# Altium schematic sheet Sheet1.SchDoc
size A3
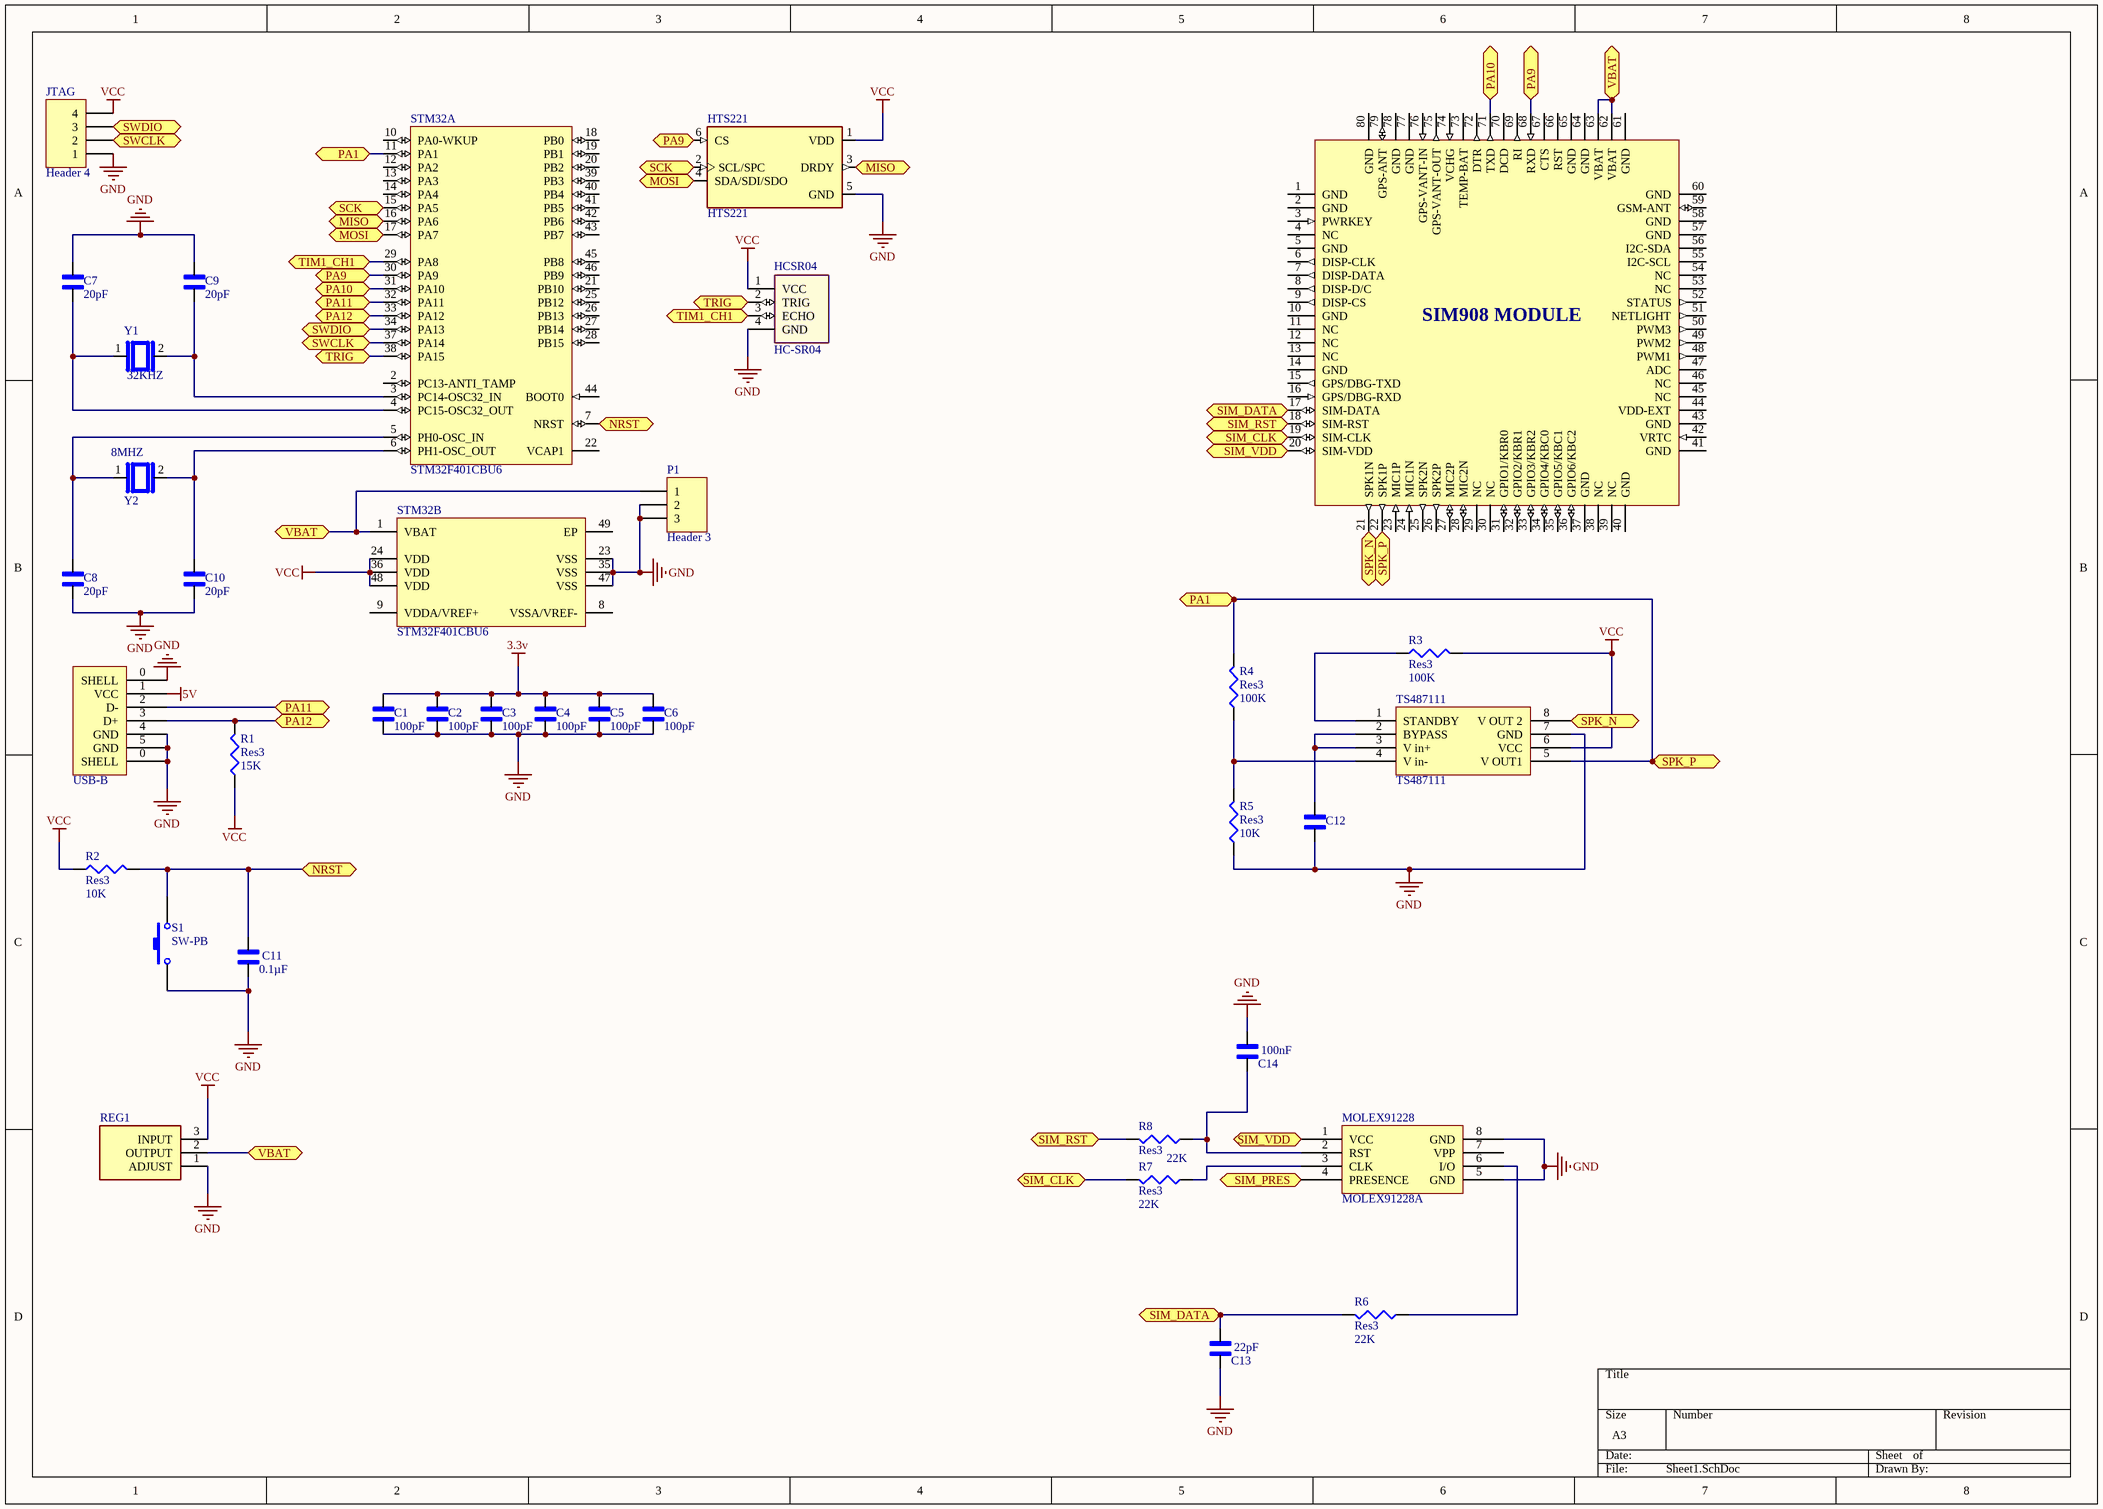
[diagram p0: Sheet1.SchDoc]

## Parts
C1  value 100pF  [CAP_CGJ3E3C0G2D101J080AA]  (hidden comment: CGJ3E3C0G2D101J080AA)
C2  value 100pF  [CAP_CGJ3E3C0G2D101J080AA]  (hidden comment: CGJ3E3C0G2D101J080AA)
C3  value 100pF  [CAP_CGJ3E3C0G2D101J080AA]  (hidden comment: CGJ3E3C0G2D101J080AA)
C4  value 100pF  [CAP_CGJ3E3C0G2D101J080AA]  (hidden comment: CGJ3E3C0G2D101J080AA)
C5  value 100pF  [CAP_CGJ3E3C0G2D101J080AA]  (hidden comment: CGJ3E3C0G2D101J080AA)
C6  value 100pF  [CAP_CGJ3E3C0G2D101J080AA]  (hidden comment: CGJ3E3C0G2D101J080AA)
C7  value 20pF  [CAP_CGJ3E3C0G2D101J080AA]  (hidden comment: CGJ3E3C0G2D101J080AA)
C8  value 20pF  [CAP_CGJ3E3C0G2D101J080AA]  (hidden comment: CGJ3E3C0G2D101J080AA)
C9  value 20pF  [CAP_CGJ3E3C0G2D101J080AA]  (hidden comment: CGJ3E3C0G2D101J080AA)
C10  value 20pF  [CAP_CGJ3E3C0G2D101J080AA]  (hidden comment: CGJ3E3C0G2D101J080AA)
C11  value 0.1µF  [CAP_CGJ3E3C0G2D101J080AA]  (hidden comment: CGJ3E3C0G2D101J080AA)
C12  CGJ3E3C0G2D101J080AA  [CAP_CGJ3E3C0G2D101J080AA]  (value not drawn)
C13  value 22pF  [CAP_CGJ3E3C0G2D101J080AA]  (hidden comment: CGJ3E3C0G2D101J080AA)
C14  value 100nF  [CAP_CGJ3E3C0G2D101J080AA]  (hidden comment: CGJ3E3C0G2D101J080AA)
HCSR04  HC-SR04  [XCVR_HC-SR04]
HTS221  HTS221  [XDCR_HTS221]
JTAG  Header 4  [HDR1X4]
MOLEX91228  MOLEX91228A  [PCBComponent_1]
P1  Header 3  [HDR1X3]
R1  Res3  value 15K  [J1-0603]
R2  Res3  value 10K  [J1-0603]
R3  Res3  value 100K  [J1-0603]
R4  Res3  value 100K  [J1-0603]
R5  Res3  value 10K  [J1-0603]
R6  Res3  value 22K  [J1-0603]
R7  Res3  value 22K  [J1-0603]
R8  Res3  value 22K  [J1-0603]
REG1  LM317KC  [TO254P470X1016X1965-3P]  (value not drawn)
S1  SW-PB  [SPST-2]
SIM908  SIM908  [Sim 908]  (value not drawn)
STM32  STM32F401CBU6  [STM-UFQFPN48_N]  (parts A,B of 2)
TS487111  TS487111  [TS4871B]
USB-B  USB connector  [usb_B]  (value not drawn)
Y1  value 32KHZ  [XTAL_CM9V-T1A-32.768KHZ-7PF-20PPM-TA-QC]  (hidden comment: CM9V-T1A-32.768KHZ-7PF-20PPM-TA-QC)
Y2  value 8MHZ  [XTAL_CM9V-T1A-32.768KHZ-7PF-20PPM-TA-QC]  (hidden comment: CM9V-T1A-32.768KHZ-7PF-20PPM-TA-QC)

## Ports
MISO, MOSI, NRST, PA1, PA9, PA10, PA11, PA12, SCK, SIM_CLK, SIM_DATA, SIM_PRES, SIM_RST, SIM_VDD, SPK_N, SPK_P, SWCLK, SWDIO, TIM1_CH1, TRIG, VBAT

## Nets
3.3v: C1.2 C2.2 C3.2 C4.2 C5.2 C6.2
5V: USB-B.1(VCC)
GND: C1.1 C2.1 C3.1 C4.1 C5.1 C6.1 C7.2 C8.1 C9.2 C10.1 C11.1 C12.1 C13.1 C14.2 HCSR04.4(GND) HTS221.5(GND) JTAG.1 MOLEX91228.5(GND) MOLEX91228.8(GND) P1.2 P1.3 R5.1 REG1.1(ADJUST) S1.1 STM32.23(VSS) STM32.35(VSS) STM32.47(VSS) TS487111.7(GND) USB-B.0(SHELL) USB-B.4(GND) USB-B.5(GND)
VCC: HCSR04.1(VCC) HTS221.1(VDD) JTAG.4 R1.1 R2.1 R3.2 REG1.3(INPUT) STM32.24(VDD) STM32.36(VDD) STM32.48(VDD) TS487111.6(VCC)
MISO: HTS221.3(DRDY) STM32.16(PA6) ; port MISO
MOSI: HTS221.4(SDA/SDI/SDO) STM32.17(PA7) ; port MOSI
NRST: C11.2 R2.2 S1.2 STM32.7(NRST) ; port NRST
PA1: R4.2 SIM908.22(SPK1P) STM32.11(PA1) TS487111.5(V_OUT1) ; port PA1, port SPK_P
PA9: HTS221.6(CS) SIM908.68(RXD) STM32.30(PA9) ; port PA9
PA10: SIM908.71(TXD) STM32.31(PA10) ; port PA10
PA11: STM32.32(PA11) USB-B.2(D-) ; port PA11
PA12: R1.2 STM32.33(PA12) USB-B.3(D+) ; port PA12
SCK: HTS221.2(SCL/SPC) STM32.15(PA5) ; port SCK
SIM_CLK: R7.2 SIM908.19(SIM-CLK) ; port SIM_CLK
SIM_DATA: C13.2 R6.2 SIM908.17(SIM-DATA) ; port SIM_DATA
SIM_PRES: MOLEX91228.4(PRESENCE) ; port SIM_PRES
SIM_RST: R8.2 SIM908.18(SIM-RST) ; port SIM_RST
SIM_VDD: MOLEX91228.1(VCC) SIM908.20(SIM-VDD) ; port SIM_VDD
SPK_N: SIM908.21(SPK1N) TS487111.8(V_OUT_2) ; port SPK_N
SWCLK: JTAG.2 STM32.37(PA14) ; port SWCLK
SWDIO: JTAG.3 STM32.34(PA13) ; port SWDIO
TIM1_CH1: HCSR04.3(ECHO) STM32.29(PA8) ; port TIM1_CH1
TRIG: HCSR04.2(TRIG) STM32.38(PA15) ; port TRIG
VBAT: P1.1 REG1.2(OUTPUT) SIM908.62(VBAT) SIM908.63(VBAT) STM32.1(VBAT) ; port VBAT
NetC7_1: C7.1 STM32.4(PC15-OSC32_OUT) Y1.1
NetC8_2: C8.2 STM32.5(PH0-OSC_IN) Y2.1
NetC9_1: C9.1 STM32.3(PC14-OSC32_IN) Y1.2
NetC10_2: C10.2 STM32.6(PH1-OSC_OUT) Y2.2
NetC12_2: C12.2 TS487111.2(BYPASS) TS487111.3(V_in+)
NetC14_1: C14.1 MOLEX91228.2(RST) R8.1
NetMOLEX91228_3: MOLEX91228.3(CLK) R7.1
NetMOLEX91228_6: MOLEX91228.6(I/O) R6.1
NetR3_1: R3.1 TS487111.1(STANDBY)
NetR4_1: R4.1 R5.2 TS487111.4(V_in-)

Not connected (* = marked no-connect by the designer): MOLEX91228 7(VPP); SIM908 1(GND) 2(GND) 3(PWRKEY) 4(NC) 5(GND) 6(DISP-CLK) 7(DISP-DATA) 8(DISP-D/C) 9(DISP-CS) 10(GND) 11(NC) 12(NC) 13(NC) 14(GND) 15(GPS/DBG-TXD) 16(GPS/DBG-RXD) 23(MIC1P) 24(MIC1N) 25(SPK2N) 26(SPK2P) 27(MIC2P) 28(MIC2N) 29(NC) 30(NC) 31(GPIO1/KBR0) 32(GPIO2/KBR1) 33(GPIO3/KBR2) 34(GPIO4/KBC0) 35(GPIO5/KBC1) 36(GPIO6/KBC2) 37(GND) 38(NC) 39(NC) 40(GND) 41(GND) 42(VRTC) 43(GND) 44(VDD-EXT) 45(NC) 46(NC) 47(ADC) 48(PWM1) 49(PWM2) 50(PWM3) 51(NETLIGHT) 52(STATUS) 53(NC) 54(NC) 55(I2C-SCL) 56(I2C-SDA) 57(GND) 58(GND) 59(GSM-ANT) 60(GND) 61(GND) 64(GND) 65(GND) 66(RST) 67(CTS) 69(RI) 70(DCD) 72(DTR) 73(TEMP-BAT) 74(VCHG) 75(GPS-VANT-OUT) 76(GPS-VANT-IN) 77(GND) 78(GND) 79(GPS-ANT) 80(GND); STM32 2(PC13-ANTI_TAMP) 8(VSSA/VREF-) 9(VDDA/VREF+) 10(PA0-WKUP) 12(PA2) 13(PA3) 14(PA4) 18(PB0) 19(PB1) 20(PB2) 21(PB10) 22(VCAP1) 25(PB12) 26(PB13) 27(PB14) 28(PB15) 39(PB3) 40(PB4) 41(PB5) 42(PB6) 43(PB7) 44(BOOT0) 45(PB8) 46(PB9) 49(EP)

## Notes on the sheet
- (in symbol SIM908) SIM908 MODULE

## Library data of the parts
C1-C11 C13 C14 = CGJ3E3C0G2D101J080AA: High Reliability - Autograde Plus+ / 7 (180mm); MF: TDK; Price: None; SnapEDA_Link: https://www.snapeda.com/parts/CGJ3E3C0G2D101J080AA/TDK/view-part/?ref=snap; MP: CGJ3E3C0G2D101J080AA; Purchase-URL: https://pricing.snapeda.com/search/part/CGJ3E3C0G2D101J080AA/?ref=eda; Availability: In Stock; Package: 1608-2 TDK; Check_prices: https://www.snapeda.com/parts/CGJ3E3C0G2D101J080AA/TDK/view-part/?ref=eda
C12 = CGJ3E3C0G2D101J080AA: High Reliability - Autograde Plus+ / 7 (180mm); Value: 1µF; MF: TDK; Price: None; SnapEDA_Link: https://www.snapeda.com/parts/CGJ3E3C0G2D101J080AA/TDK/view-part/?ref=snap; MP: CGJ3E3C0G2D101J080AA; Purchase-URL: https://pricing.snapeda.com/search/part/CGJ3E3C0G2D101J080AA/?ref=eda; Availability: In Stock; Package: 1608-2 TDK; Check_prices: https://www.snapeda.com/parts/CGJ3E3C0G2D101J080AA/TDK/view-part/?ref=eda
HCSR04 = HC-SR04: Ultrasonic Sensor Module; Availability: Unavailable; MP: HC-SR04; Value: *; Price: None; Package: None
HTS221 = HTS221: Humidity Temperature Sensor 0 ~ 100% RH IÂ²C, SPI Â±4.5% RH 10 s Surface Mount; MF: STMicroelectronics; Check_prices: https://www.snapeda.com/parts/HTS221/STMicroelectronics/view-part/?ref=eda; Value: *; Purchase-URL: https://pricing.snapeda.com/search/part/HTS221/?ref=eda; Price: None; MP: HTS221; SnapEDA_Link: https://www.snapeda.com/parts/HTS221/STMicroelectronics/view-part/?ref=snap; Availability: In Stock; Package: VFLGA-6 STMicroelectronics
JTAG = Header 4: Header, 4-Pin; LatestRevisionDate: 17-Jul-2002; LatestRevisionNote: Re-released for DXP Platform.; Publisher: Altium Limited
MOLEX91228 TS487111 = Component_1
P1 = Header 3: Header, 3-Pin; LatestRevisionDate: 17-Jul-2002; LatestRevisionNote: Re-released for DXP Platform.; Publisher: Altium Limited
R1-R8 = Res3: Resistor; Published: 8-Jun-2000; LatestRevisionDate: 29-May-2009; LatestRevisionNote: IPC-7351 Footprint Added.; PackageReference: J1-0603; Publisher: Altium Limited; PackageDescription: Chip Resistor
REG1 = LM317KC: Linear Voltage Regulators 3-Term Adj. Pos.; Manufacturer_Name: Texas Instruments; Geometry.Height: 4.7mm; Manufacturer_Part_Number: LM317KC; Mouser Part Number: 595-LM317KC; Mouser Price/Stock: https://www.mouser.co.uk/ProductDetail/Texas-Instruments/LM317KC?qs=8Pd2FuFSoMGLeOqH74v9JA%3D%3D; Arrow Part Number: *; Arrow Price/Stock: *; Datasheet Link: http://www.ti.com/general/docs/suppproductinfo.tsp?distId=26&gotoUrl=http%3A%2F%2Fwww.ti.com%2Flit%2Fgpn%2Flm317
S1 = SW-PB: Switch; Published: 24-Mar-1999; LatestRevisionDate: 17-Jul-2002; LatestRevisionNote: Re-released for DXP Platform.; PackageReference: SPST-2; Publisher: Altium Limited; PackageDescription: Switch; 2 Leads
STM32 = STM32F401CBU6: ARM Cortex-M4 32-bit MCU+FPU, 105 DMIPS, 128 kB Flash, 64 kB Internal RAM, 36 I/Os, 48-pin UFQFPN, -40 to 85 degC, Tray; Manufacturer: STMicroelectronics; FLASH Size (Prog) (kB): 128; I/Os (High Current): 36; Internal RAM Size (kB): 64; Operating Frequency(F) (Processor speed) (MHz): 84; Supply Voltage(Vcc) max (V): 3.6; Supply Voltage(Vcc) min (V): 1.8; DatasheetVersion: Rev. 1; PackageVersion: Rev. 1, 04/2013; PackageReference: UFQFPN48; PackageDescription: 48-Pin Ultra Thin Fine Pitch Quad Flat No-Lead, 7 x 7 x 0.6 mm Body, 0.5 mm Pitch, Exposed Pad; Supplier 1: Newark; Supplier Part Number 1: 19X6215; Supplier 2: Mouser; Supplier Part Number 2: 511-STM32F401CBU6; Core: ARM Cortex-M4; Packing: Tray; Mounting Technology: Surface Mount; PartNumber: STM32F401CBU6; ComponentLink1Description: Manufacturer URL; ComponentLink1URL: http://www.st.com/web/en/home.html; ComponentLink2Description: Datasheet; ComponentLink2URL: http://www.st.com/st-web-ui/static/active/en/resource/technical/document/data_brief/DM00071938.pdf; ComponentLink3Description: Package Specification; ComponentLink3URL: http://www.st.com/st-web-ui/static/active/en/resource/technical/document/data_brief/DM00071938.pdf
USB-B = USB-B
Y1 Y2 = CM9V-T1A-32.768KHZ-7PF-20PPM-TA-QC: Tuning Fork Crystal 32.768kHz in 1.0x 1.6mm package; MF: Micro Crystal; SnapEDA_Link: https://www.snapeda.com/parts/CM9V-T1A-32.768KHZ-7PF-20PPM-TA-QC/Micro+Crystal/view-part/?ref=snap; Package: SMD-2 Micro Crystal; MP: CM9V-T1A-32.768KHZ-7PF-20PPM-TA-QC; Check_prices: https://www.snapeda.com/parts/CM9V-T1A-32.768KHZ-7PF-20PPM-TA-QC/Micro+Crystal/view-part/?ref=eda